# EAGLE design PCB (EAGLE 9.6.1)
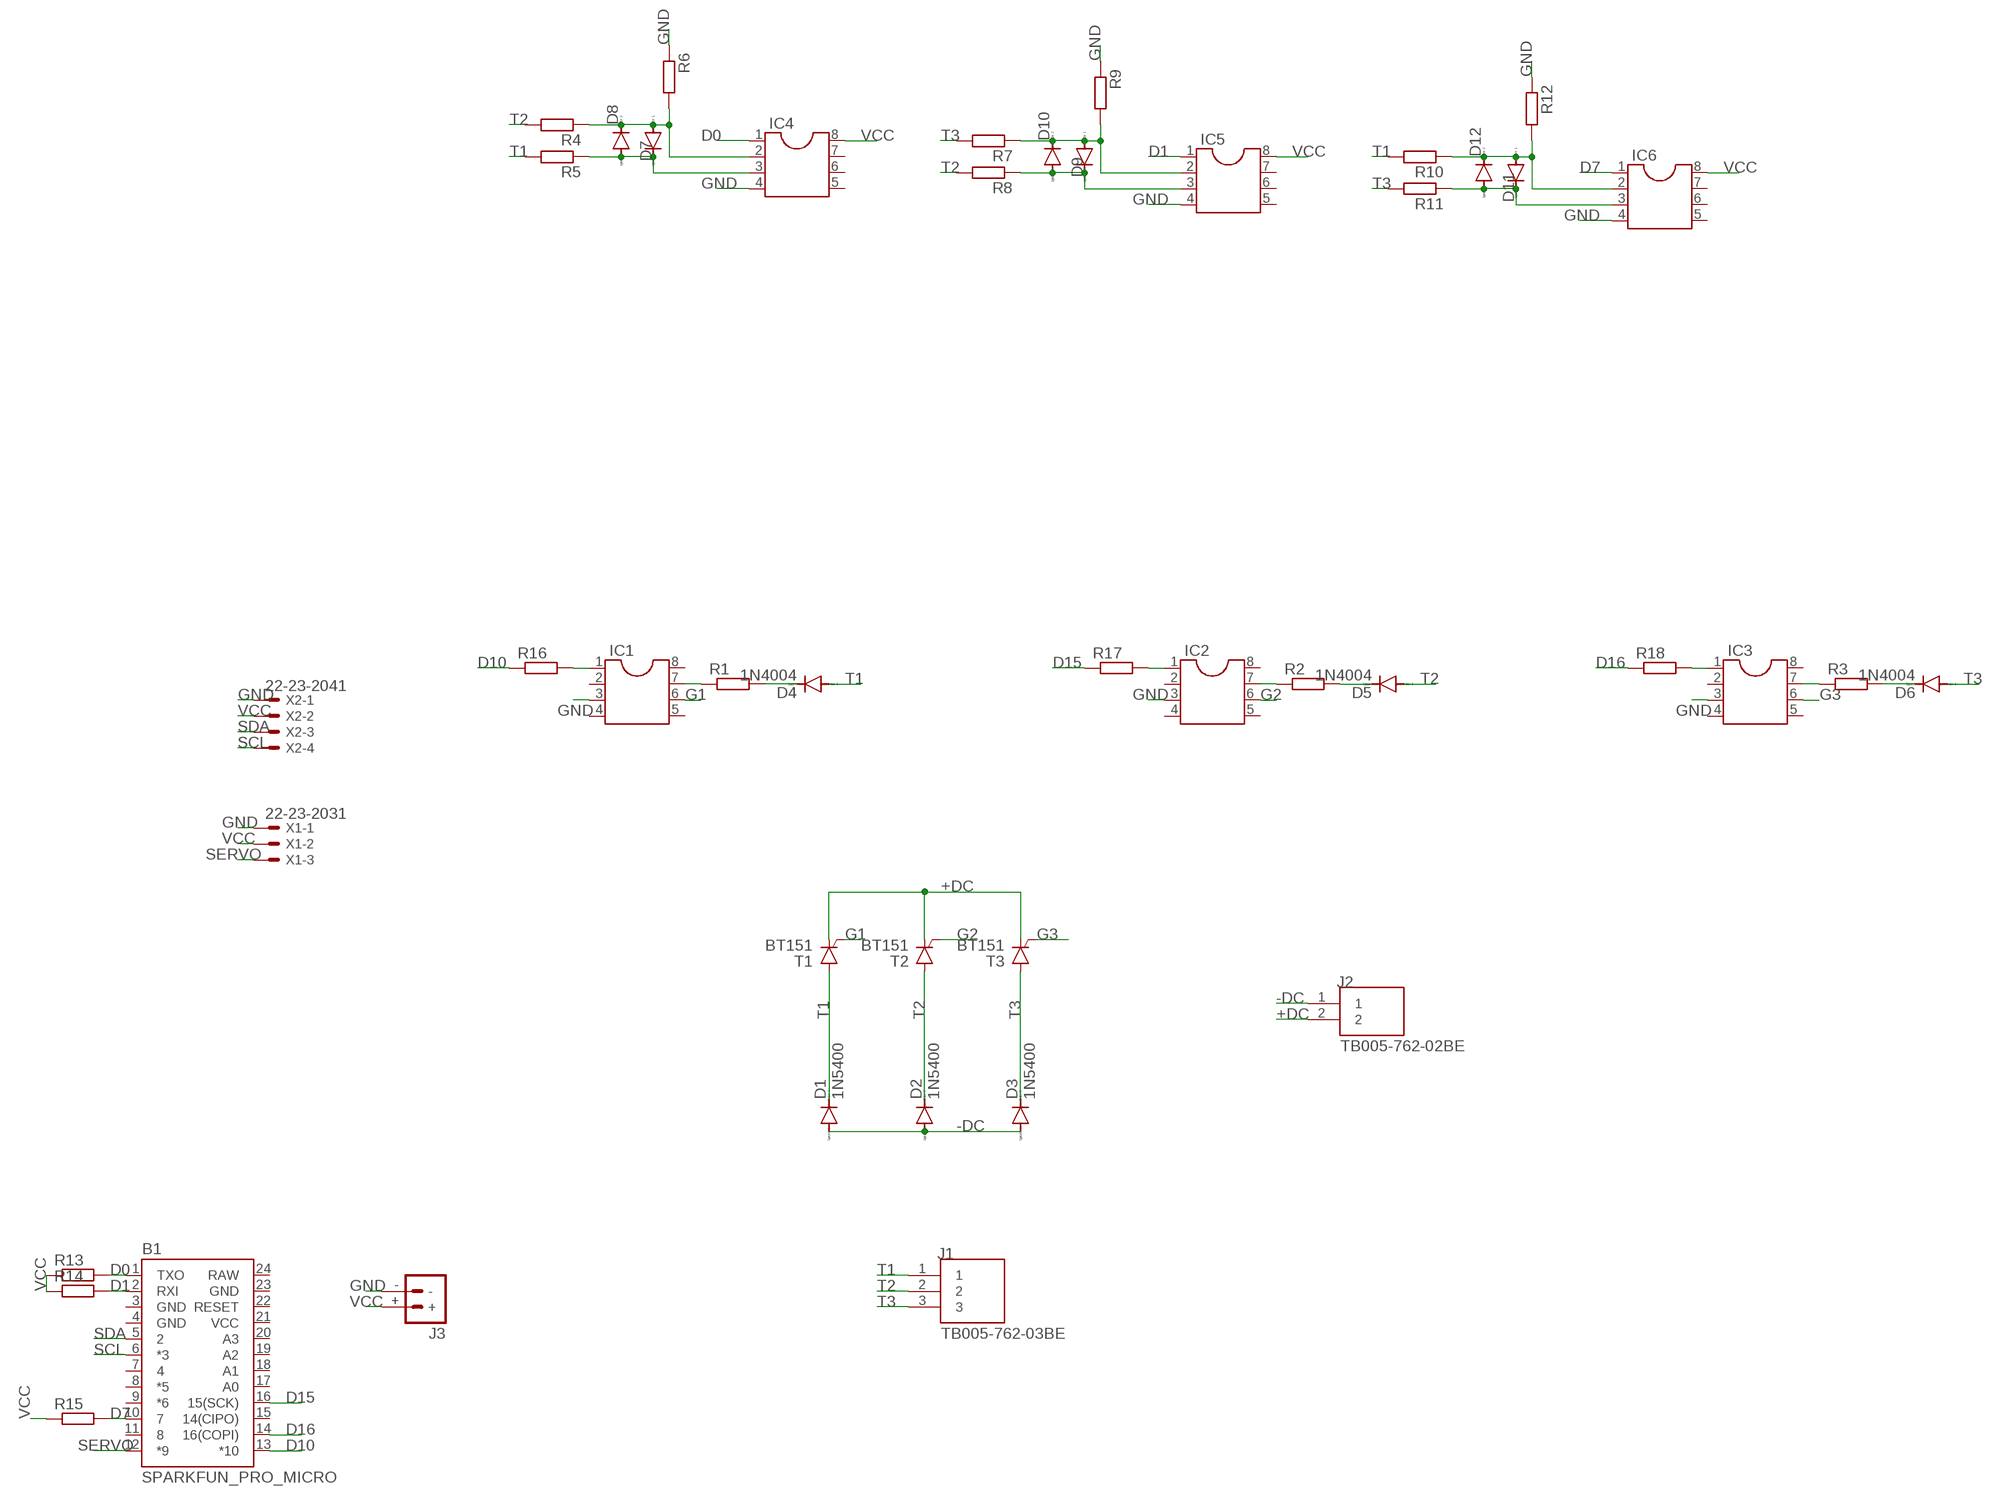
[diagram p0: schematic, sheet 1]

## Parts
B1  SPARKFUN_PRO_MICRO  [SPARKFUN_PRO_MICRO]
D1  1N5400  [DO201-15]
D2  1N5400  [DO201-15]
D3  1N5400  [DO201-15]
D4  1N4004  [DO41-10]
D5  1N4004  [DO41-10]
D6  1N4004  [DO41-10]
D7  1N4004  [DO41-10]
D8  1N4004  [DO41-10]
D9  1N4004  [DO41-10]
D10  1N4004  [DO41-10]
D11  1N4004  [DO41-10]
D12  1N4004  [DO41-10]
IC1  DIL8  [DIL08]
IC2  DIL8  [DIL08]
IC3  DIL8  [DIL08]
IC4  DIL8  [DIL08]
IC5  DIL8  [DIL08]
IC6  DIL8  [DIL08]
J1  TB005-762-03BE  [CUI_TB005-762-03BE]
J2  TB005-762-02BE  [CUI_TB005-762-02BE]
J3  BATTERY_CONN_DEANS  [DEANS]
R1  R-EU_0207/10  [0207/10]
R2  R-EU_0207/10  [0207/10]
R3  R-EU_0207/10  [0207/10]
R4  R-EU_0207/10  [0207/10]
R5  R-EU_0207/10  [0207/10]
R6  R-EU_0207/10  [0207/10]
R7  R-EU_0207/10  [0207/10]
R8  R-EU_0207/10  [0207/10]
R9  R-EU_0207/10  [0207/10]
R10  R-EU_0207/10  [0207/10]
R11  R-EU_0207/10  [0207/10]
R12  R-EU_0207/10  [0207/10]
R13  R-EU_0207/10  [0207/10]
R14  R-EU_0207/10  [0207/10]
R15  R-EU_0207/10  [0207/10]
R16  R-EU_0207/10  [0207/10]
R17  R-EU_0207/10  [0207/10]
R18  R-EU_0207/10  [0207/10]
T1  BT151  [TO220CL]
T2  BT151  [TO220CL]
T3  BT151  [TO220CL]
X1  22-23-2031  [22-23-2031]
X2  22-23-2041  [22-23-2041]

## Nets
+DC: J2.2 T1.C T2.C T3.C
-DC: D1.A D2.A D3.A J2.1
D0: B1.1(TXO) IC4.1 R13.2
D1: B1.2(RXI) IC5.1 R14.2
D7: B1.10 IC6.1 R15.2
D10: B1.13(*10) R16.1
D15: B1.16(15(SCK)) R17.1
D16: B1.14(16(COPI)) R18.1
G1: IC1.6 T1.G
G2: IC2.6 T2.G
G3: IC3.6 T3.G
GND: IC1.3 IC2.3 IC3.3 IC4.4 IC5.4 IC6.4 J3.- R6.1 R9.1 R12.1 X1.1 X2.1
N$1: IC1.1 R16.2
N$2: IC2.1 R17.2
N$3: D7.C D8.A IC4.3 R5.1
N$4: D7.A D8.C IC4.2 R4.1 R6.2
N$5: IC3.1 R18.2
N$6: IC1.7 R1.1
N$7: D4.C R1.2
N$8: IC2.7 R2.1
N$9: D5.C R2.2
N$10: IC3.7 R3.1
N$11: D6.C R3.2
N$14: D9.C D10.A IC5.3 R8.1
N$15: D9.A D10.C IC5.2 R7.1 R9.2
N$20: D11.C D12.A IC6.3 R11.1
N$21: D11.A D12.C IC6.2 R10.1 R12.2
SCL: B1.6(*3) X2.4
SDA: B1.5 X2.3
SERVO: B1.12(*9) X1.3
T1: D1.C D4.A J1.1 R5.2 R10.2 T1.A
T2: D2.C D5.A J1.2 R4.2 R8.2 T2.A
T3: D3.C D6.A J1.3 R7.2 R11.2 T3.A
VCC: IC4.8 IC5.8 IC6.8 J3.+ R13.1 R14.1 R15.1 X1.2 X2.2
Unconnected: B1.7 B1.8(*5) B1.9(*6) B1.11 B1.15(14(CIPO)) B1.17(A0) B1.18(A1) B1.19(A2) B1.20(A3) B1.22(RESET) IC1.2 IC1.4 IC1.5 IC1.8 IC2.2 IC2.4 IC2.5 IC2.8 IC3.2 IC3.4 IC3.5 IC3.8 IC4.5 IC4.6 IC4.7 IC5.5 IC5.6 IC5.7 IC6.5 IC6.6 IC6.7

## Power pins joined to a net without a drawn wire
GND: B1.3(GND) B1.4(GND) B1.23(GND)
RAW: B1.24(RAW)
VCC: B1.21(VCC)

## Library data of the parts
B1 = SparkFun-Boards:SPARKFUN_PRO_MICRO: SparkFun Pro Micro Atmega32U4 compatible footprint. SparkFun Products: 3.3V/8MHz <https://www.sparkfun.com/products/12587> 5V/16MHz <https://www.sparkfun.com/products/12640>
D1-D3 = diode:1N5400: DIODE standard rectifier, 3 A, 50 V (Motorola)
D4-D12 = diode:1N4004: DIODE general purpose rectifier, 1 A
IC1-IC6 = ic-package:DIL8: Dual In Line / Socket
J1 = TB005-762-03BE:TB005-762-03BE: Check availability <https://pricing.snapeda.com/parts/TB005-762-03BE/CUI%20Devices/view-part?ref=eda>; AVAILABILITY: In Stock; CUI_PURCHASE_URL: https://www.cuidevices.com/product/interconnect/connectors/terminal-blocks/tb005-762-series?utm_source=snapeda.com&utm_medium=referral&utm_campaign=snapedaBOM; DESCRIPTION: 2~24 Poles, Screw Type, Horizontal, 7.62 Pitch, 26~10 (AWG), Terminal Block Connector; MF: CUI Devices; MP: TB005-762-03BE; PACKAGE: None; PRICE: None; PURCHASE-URL: https://pricing.snapeda.com/search/part/TB005-762-03BE/?ref=eda
J2 = TB005-762-02BE:TB005-762-02BE; CUI_PURCHASE_URL: https://www.cuidevices.com/product/interconnect/connectors/terminal-blocks/tb005-762-series?utm_source=snapeda.com&utm_medium=referral&utm_campaign=snapedaBOM; DESCRIPTION: 2~24 Poles, Screw Type, Horizontal, 7.62 Pitch, 26~10 (AWG), Terminal Block Connector; DIGI-KEY_PART_NUMBER: 102-6189-ND; MF: CUI Devices; MP: TB005-762-02BE; PACKAGE: None; PURCHASE-URL: https://pricing.snapeda.com/search/part/TB005-762-02BE/?ref=eda
J3 = SparkFun-Connectors:BATTERY_CONN: Battery Connectors Various footprints for battery connections SparkFun Products: Deans Connector -M/F Pair <https://www.sparkfun.com/products/11864>; SF_ID: PRT-11864
R1-R18 = rcl:R-EU_: RESISTOR, European symbol; SPICEPREFIX: R
T1-T3 = triac:BT151: THYRISTOR
X1 = con-molex:22-23-2031: .100" (2.54mm) Center Header - 3 Pin; MF: MOLEX; MPN: 22-23-2031; OC_FARNELL: 1462950; OC_NEWARK: 30C0862
X2 = con-molex:22-23-2041: .100" (2.54mm) Center Header - 4 Pin; MF: MOLEX; MPN: 22-23-2041; OC_FARNELL: 1462920; OC_NEWARK: 38C0355

## Net classes
0 default: width 0.203 mm

## Board
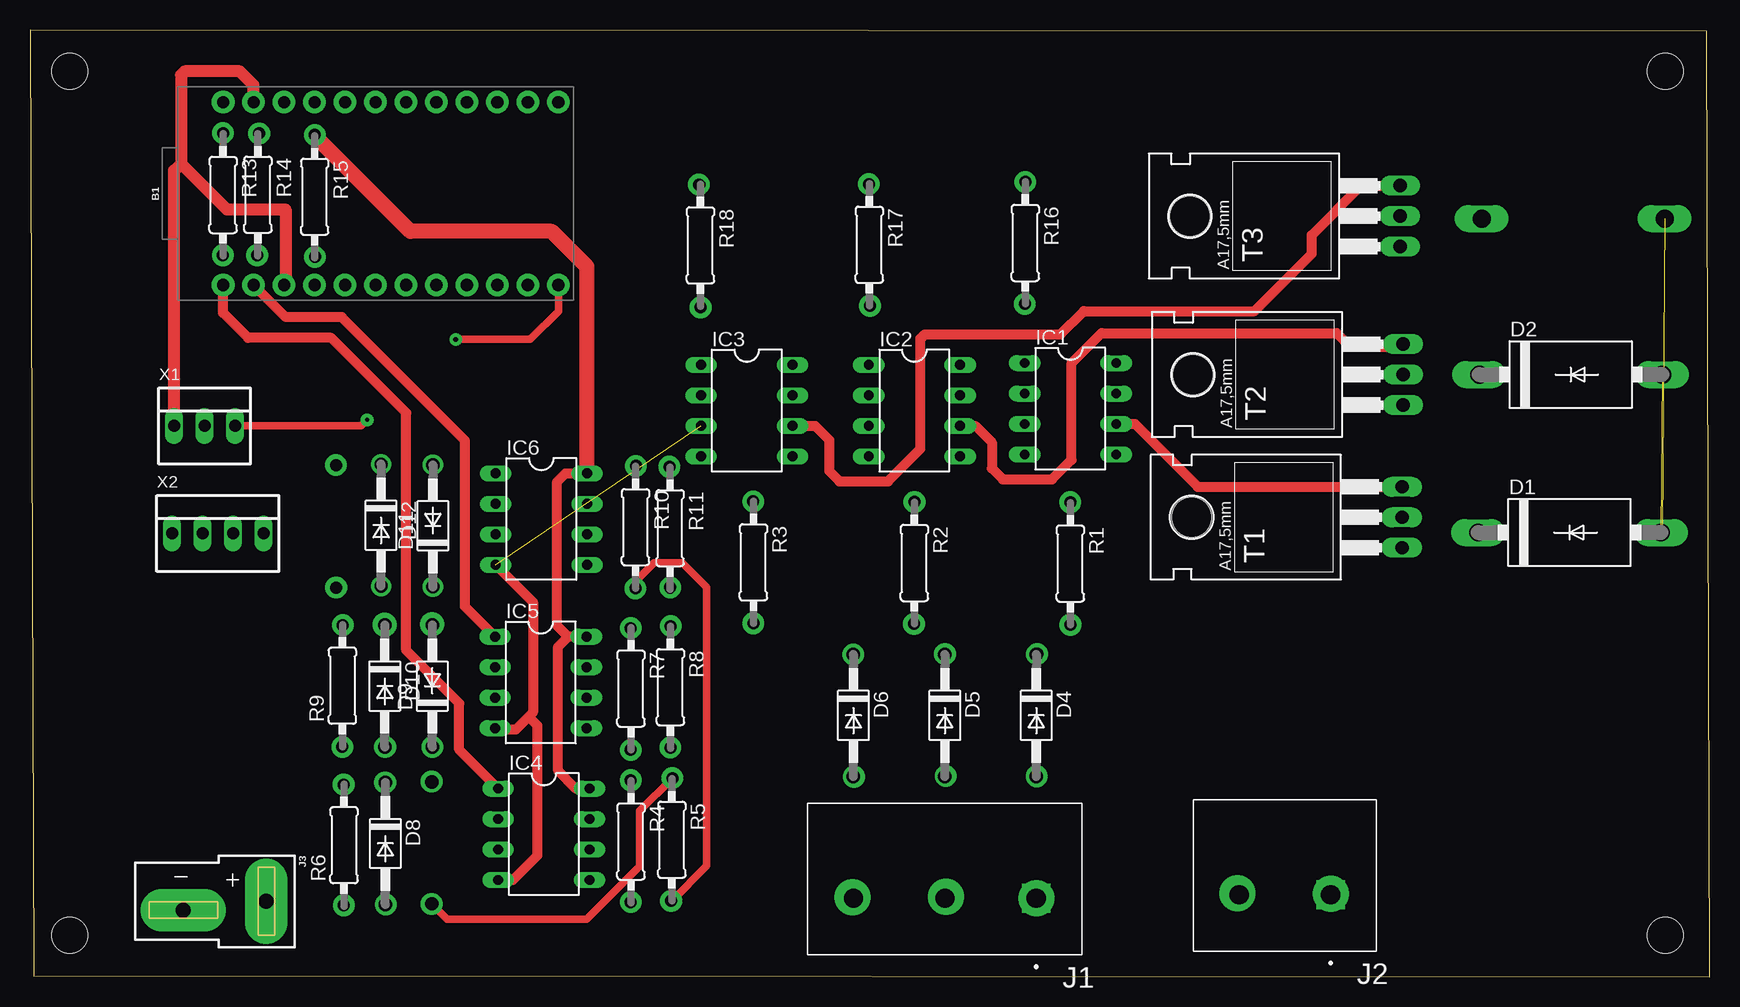
[diagram p1: board, top side]
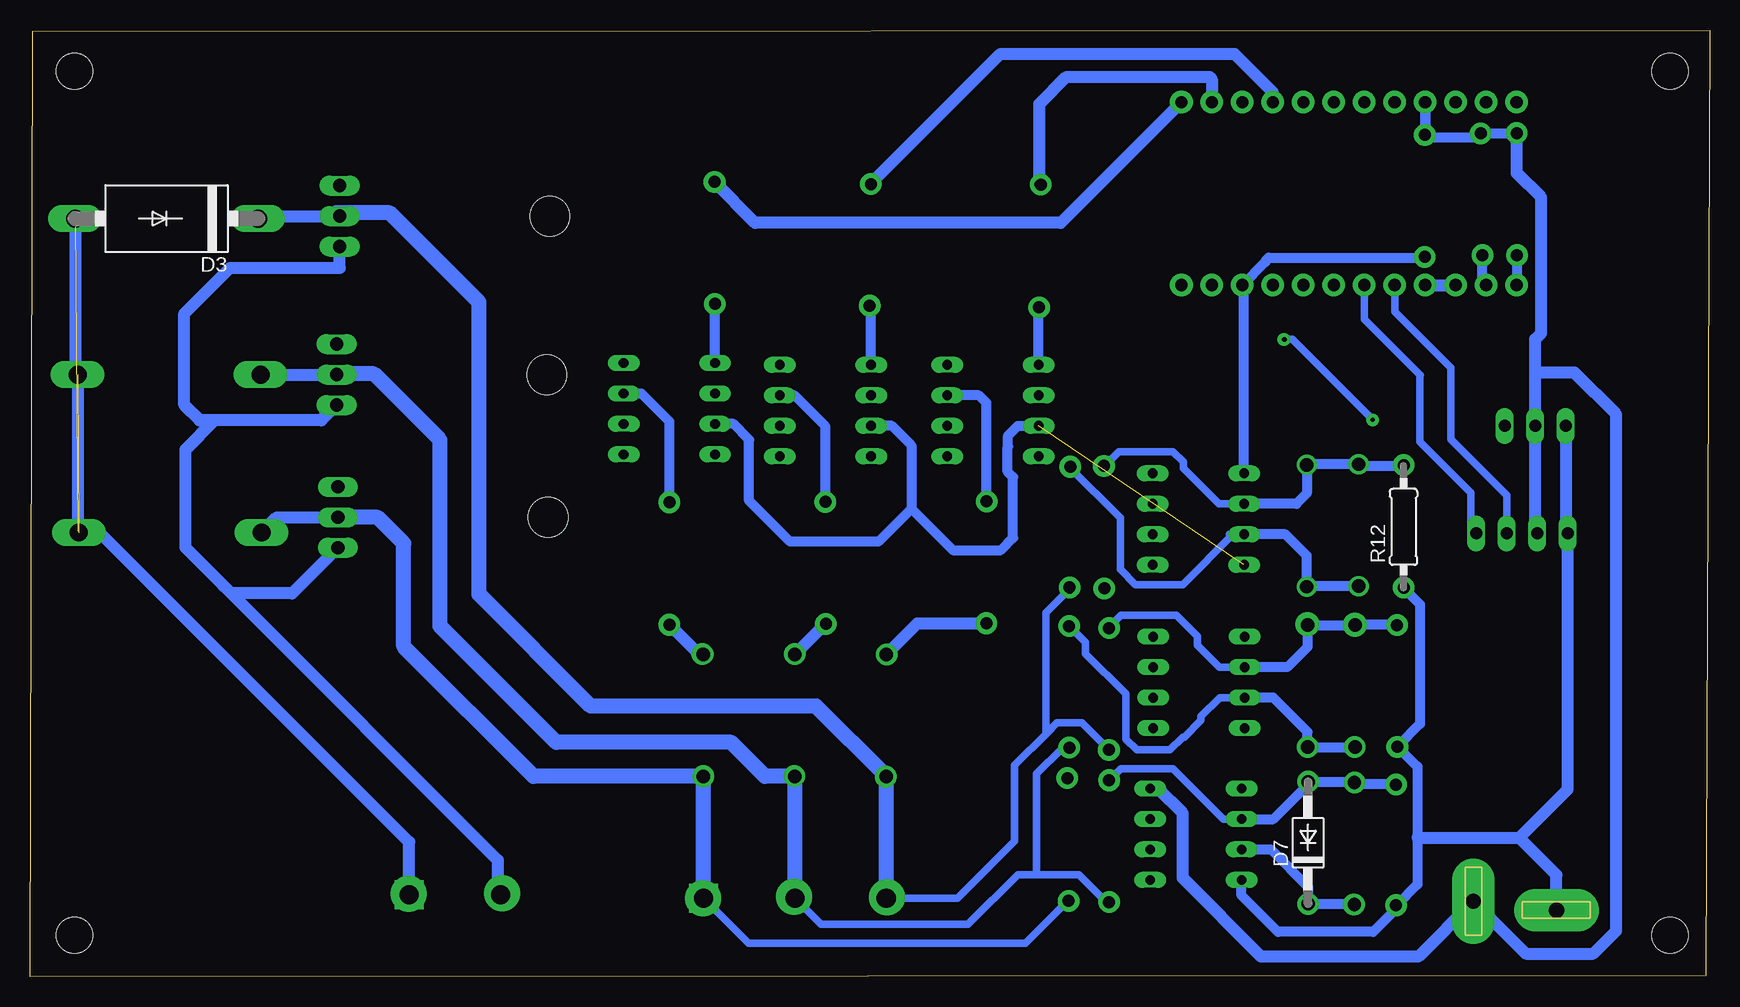
[diagram p2: board, bottom side, seen from below]

Size 140.02 x 78.89 mm. Coordinates in mm from the lower left corner, seen from the top.
Outline: 0.32,0.09 140.02,0 139.79,78.8 0,78.89 0.32,0.09
Copper layers (1*16): Top 0.035mm / dielectric 1.5mm / Bottom 0.035mm
Design rules "default": minimum track width 6mil, minimum drill 0.35mm, track to track 6mil, track to pad 6mil, pad to pad 6mil, via to via 6mil, smd to smd 6mil, copper to edge 40mil, drill to drill 6mil, minimum pad ring 10mil, minimum via ring 8mil, stop-mask expansion 4mil, vias tented up to drill 0mil, thermal gap 10mil
Holes 3 mm at 3.32,75.46 3.32,3.46 136.32,75.46 136.32,3.46

### Footprints (pad centres in the part's own frame; a part is rotated, then mirrored left to right if it is on the bottom)
SPARKFUN_PRO_MICRO = drill 1.016 pad 1.88: 1 -7.62,12.7; 2 -7.62,10.16; 3 -7.62,7.62; 4 -7.62,5.08; 5 -7.62,2.54; 6 -7.62,0; 7 -7.62,-2.54; 8 -7.62,-5.08; 9 -7.62,-7.62; 10 -7.62,-10.16; 11 -7.62,-12.7; 12 -7.62,-15.24; 13 7.62,-15.24; 14 7.62,-12.7; 15 7.62,-10.16; 16 7.62,-7.62; 17 7.62,-5.08; 18 7.62,-2.54; 19 7.62,0; 20 7.62,2.54; 21 7.62,5.08; 22 7.62,7.62; 23 7.62,10.16; 24 7.62,12.7
DO201-15 = drill 1.499 long: A 7.62,0; C -7.62,0
DO41-10 = drill 1.118: A 5.08,0; C -5.08,0
DIL08 = drill 0.813 long: 1 -3.81,-3.81; 2 -1.27,-3.81; 3 1.27,-3.81; 4 3.81,-3.81; 5 3.81,3.81; 6 1.27,3.81; 7 -1.27,3.81; 8 -3.81,3.81
CUI_TB005-762-03BE = drill 1.6 square: 1 0,0 | drill 1.6: 2 7.62,0; 3 15.24,0
CUI_TB005-762-02BE = drill 1.6 square: 1 0,0 | drill 1.6: 2 7.62,0
DEANS = drill 1.27 pad 3.556 long: + 0,0; - 0.737,-6.921
0207/10 = drill 0.813 octagon: 1 -5.08,0; 2 5.08,0
TO220CL = drill 1.118 long: A 0,-6.35; C -2.54,-6.35; G 2.54,-6.35 | hole 3.302: 0,11.176
22-23-2031 = drill 1 long: 1 -2.54,0; 2 0,0; 3 2.54,0
22-23-2041 = drill 1 long: 1 -3.81,0; 2 -1.27,0; 3 1.27,0; 4 3.81,0

### Placement (x,y rotation side)
B1  28.8,65.26 90 top
D1  128.33,37.02 0 top
D2  128.43,50.17 0 top
D3  128.63,63.18 180 bottom
D4  83.88,21.78 270 top
D5  76.26,21.78 270 top
D6  68.64,21.78 270 top
D7  33.48,11.16 90 bottom
D8  29.62,11.11 270 top
D9  33.54,24.22 90 top
D10  29.57,24.22 270 top
D11  33.59,37.58 90 top
D12  29.27,37.63 270 top
IC1  86.72,47.33 270 top
IC2  73.72,47.18 270 top
IC3  59.75,47.18 270 top
IC4  42.83,11.87 270 top
IC5  42.58,24.52 270 top
IC6  42.62,38.14 270 top
J1  83.88,6.54 180 top
J2  108.42,6.84 180 top
J3  19.7,6.28 270 top
R1  86.72,34.43 270 top
R2  73.72,34.48 270 top
R3  60.31,34.53 270 top
R4  50.1,11.26 270 top
R5  53.5,11.41 270 top
R6  26.18,10.96 90 top
R7  50.1,24.01 270 top
R8  53.38,24.13 270 top
R9  26.04,24.25 90 top
R10  50.48,37.47 270 top
R11  53.36,37.38 270 top
R12  25.53,37.49 90 bottom
R13  16.1,65.15 270 top
R14  18.99,65.17 270 top
R15  23.73,65 270 top
R16  82.96,61.15 270 top
R17  69.96,60.99 270 top
R18  55.89,60.94 270 top
T1  108.01,38.29 90 top
T2  108.11,50.17 90 top
T3  107.86,63.38 90 top
X1  14.56,45.9 0 top
X2  15.65,36.94 0 top

### Tracks (layer width: path | path; a pad name or v marks a point on that pad's centre or on a via)
+DC
  Bottom 1.016: T2.C 115.73,46.36 124.62,46.36 | 124.62,46.36 125.89,46.36 127.16,47.63 127.16,55.25 123.35,59.06 114.21,59.06 T3.C | T1.C 118.17,31.94 123.25,31.94 | 124.62,46.36 127.06,43.93 127.06,35.75 123.88,32.57 123.25,31.94 | 123.25,31.94 101.02,9.71 101.02,7.98 100.79,7.76 J2.2
-DC  (2 unrouted)
  Bottom 1.016: D3.A 136.25,50.38 D2.A 136.05,37.12 D1.A 134.22,37.02 108.41,11.21 J2.1
D0
  Top 0.813: IC4.1 35.78,18.92 35.78,22.77 31.37,27.19 31.37,46.99 25.12,53.24 18.18,53.24 16.1,55.32 B1.1
  Bottom 0.813: R13.2 B1.1
D1
  Top 0.813: IC5.1 36.26,30.84 36.26,44.68 25.98,54.96 21.32,54.96 B1.2
  Bottom 0.813: R14.2 18.99,57.99 B1.2
D7
  Bottom 0.813: R15.2 36.77,59.92 37.03,59.66 37.03,59.57 B1.10 38.81,57.49 IC6.1
D10
  Bottom 1.016: B1.13 54.1,62.83 79.56,62.83 R16.1
D15
  Bottom 1.016: R17.1 59.12,76.91 39.62,76.91 36.42,73.72 B1.16
D16
  Bottom 1.016: R18.1 55.89,72.7 53.61,74.98 41.68,74.98 41.5,74.8 B1.14
G1
  Top 0.813: IC1.6 92.11,46.06 97.34,40.83 T1.G
G2
  Top 0.813: IC2.6 78.8,45.91 80.17,44.54 80.17,42.35 81.08,41.44 85.2,41.44 86.82,43.06 86.82,51.14 89.31,53.63 108.92,53.63 110.04,52.51 114.26,52.51 T2.G
G3
  Top 0.813: IC3.6 65.44,45.91 66.61,44.74 66.61,42.15 67.47,41.28 71.53,41.28 74.23,43.98 74.23,50.58 74.23,51.19 74.23,53.17 74.58,53.53 85.91,53.53 87.84,55.46 102.06,55.46 106.84,60.23 106.84,61.81 110.95,65.92 T3.G
GND  (1 unrouted)
  Top 0.813: IC6.4 41.94,31.21 41.94,22.04 41.56,21.66 | 41.56,21.66 40.48,20.58 38.9,20.58 IC5.4 | 41.56,21.66 42.28,20.95 42.28,10.08 40.26,8.06 IC4.4
  Top 1.016: B1.23 18.64,74.3 17.49,75.45 12.89,75.45 12.59,75.15 12.59,67.75 | B1.3 21.3,57.76 21.3,63.94 16.4,63.94 12.59,67.75 | X1.1 12.02,67.18 12.59,67.75
  Bottom 0.813: IC2.3 68.18,45.91 66.56,44.28 66.56,39 | 66.56,39 63.1,35.54 59.09,35.54 58.07,36.56 58.07,41.64 58.53,42.1 58.53,44.13 58.48,44.18 58.48,45.09 57.67,45.91 IC3.3 | 66.56,39 69.3,36.26 76.66,36.26 80.07,39.66 80.07,44.74 81.39,46.06 IC1.3 | R12.1 24.15,31.03 24.15,21.07 R9.1 24.37,17.5 24.37,11.58 24.37,7.68 R6.1 26.18,5.62 28.05,3.75 35.99,3.75 39.02,6.78 IC4.4
  Bottom 1.016: J3.- 12.77,8.48 15.88,11.58 | 24.37,11.58 15.88,11.58 | 15.88,11.58 11.84,15.62 X2.1 12.02,37.11 X1.1 | B1.4 B1.3
N$1
  Bottom 0.813: R16.2 82.96,51.19 IC1.1
N$2
  Bottom 0.813: IC2.1 69.91,55.86 R17.2
N$3
  Top 0.61: D7.C 34.78,4.78 46.41,4.78 50.82,9.19 50.82,13.82 R5.1
  Bottom 0.813: D8.A 29.67,6.08 D7.C 33.48,7.5 36.58,10.6 IC4.3
N$4
  Bottom 0.61: IC4.2 40.54,13.14 44.74,17.34 49.1,17.34 R4.1
  Bottom 0.813: 33.43,16.19 D8.C 29.48,16.04 R6.2 | 33.43,16.19 D7.A | IC4.2 36.38,13.14 33.43,16.09 33.43,16.19
N$5
  Bottom 0.813: IC3.1 55.94,55.81 R18.2
N$6
  Bottom 0.813: R1.1 86.72,46.26 89.06,48.6 IC1.7
N$7
  Bottom 1.016: R1.2 84.23,26.86 D4.C
N$8
  Bottom 0.813: R2.1 73.72,45.86 76.31,48.45 IC2.7
N$9
  Bottom 1.016: D5.C R2.2
N$10
  Bottom 0.813: R3.1 60.31,47.84 60.92,48.45 IC3.7
N$11
  Bottom 1.016: D6.C 66.05,29.45 R3.2
N$12  (via drill 0.35 pad 1.05)
  other vias: 28.1,46.41
N$13  (via drill 1 pad 2)
  other vias: 33.52,29.36
N$14
  Bottom 0.61: IC5.3 40.85,23.25 42.4,21.7 42.4,21.36 43.8,19.95 43.93,19.95 44.99,18.89 47.76,18.89 48.66,19.8 48.66,23.57 52.02,26.93 52.02,27.86 R8.1
  Bottom 0.813: D10.A D9.C 33.54,20.41 36.38,23.25 IC5.3
N$15
  Bottom 0.61: R7.1 49.07,30.12 44.47,30.12 42.71,28.37 42.71,27.62 40.89,25.79 IC5.2
  Bottom 0.813: IC5.2 35.21,25.79 33.54,27.47 D9.A D10.C 29.54,29.33 R9.2
N$16  (via drill 1 pad 2)
  other vias: 29.58,29.31
N$17  (via drill 1 pad 1.8)
  other vias: 26.07,29.29
N$18  (via drill 1 pad 1.8)
  other vias: 25.52,32.43
N$19  (via drill 1 pad 1.8)
  other vias: 25.51,42.63
N$20
  Bottom 0.61: IC6.3 40.03,36.87 | 53.36,42.47 R11.1 49.13,38.23 49.13,33.94 47.87,32.68 43.92,32.68 39.74,36.87 38.41,36.87
  Bottom 0.813: D12.A 33.54,32.55 D11.C 33.59,35.09 35.37,36.87 38.41,36.87 IC6.3
N$21
  Bottom 0.61: 50.48,42.02 R10.1 49.26,43.76 44.73,43.76 43.88,42.91 43.88,42.37 40.92,39.41 IC6.2
  Bottom 0.813: IC6.2 34.45,39.41 33.59,40.27 D11.A 33.54,42.71 D12.C 29.13,42.57 R12.2
N$22  (via drill 1 pad 1.8)
  other vias: 23.76,59.98
N$23  (via drill 1 pad 1.8)
  other vias: 18.94,60.12
N$24  (via drill 1 pad 1.8)
  other vias: 16.07,60.12
N$25  (via drill 1 pad 1.8)
  other vias: 16.09,70.31
N$26  (via drill 1 pad 1.8)
  other vias: 19.1,70.28
N$27  (via drill 1 pad 1.8)
  other vias: 23.75,70.15
N$28  (via drill 1 pad 1.8)
  other vias: 55.76,66.01
N$29  (via drill 1 pad 1.8)
  other vias: 55.9,55.78
N$30  (via drill 1 pad 1.8)
  other vias: 70.02,55.92
N$31  (via drill 1 pad 1.8)
  other vias: 69.93,66.06
N$32  (via drill 1 pad 1.8)
  other vias: 82.96,66.24
N$33  (via drill 1 pad 1.8)
  other vias: 82.92,56.07
N$34  (via drill 1 pad 1.8)
  other vias: 60.3,29.46
N$35  (via drill 1 pad 1.8)
  other vias: 73.69,29.4
N$36  (via drill 1 pad 1.8)
  other vias: 86.73,29.33
N$37  (via drill 1 pad 1.8)
  other vias: 86.72,39.54
N$38  (via drill 1 pad 1.8)
  other vias: 73.73,39.56
N$39  (via drill 1 pad 1.8)
  other vias: 60.28,39.61
N$40  (via drill 1 pad 1.8)
  other vias: 53.3,42.49
N$41  (via drill 1 pad 1.8)
  other vias: 50.5,42.57
N$42  (via drill 1 pad 1.8)
  other vias: 53.36,32.45
N$43  (via drill 1 pad 1.8)
  other vias: 50.47,32.35
N$44  (via drill 1 pad 1.8)
  other vias: 50.07,29.05
N$45  (via drill 1 pad 1.8)
  other vias: 53.41,29.21
N$46  (via drill 1 pad 1.8)
  other vias: 50.07,16.37
N$47  (via drill 1 pad 1.8)
  other vias: 53.55,16.55
N$48  (via drill 1 pad 1.8)
  other vias: 53.39,19.09
N$49  (via drill 1 pad 1.8)
  other vias: 50.08,18.9
N$50  (via drill 1 pad 1.8)
  other vias: 50.08,6.21
N$51  (via drill 1 pad 1.8)
  other vias: 53.44,6.32
N$52  (via drill 1 pad 1.8)
  other vias: 33.48,6.05
N$53  (via drill 1 pad 1.8)
  other vias: 29.66,6.03
N$54  (via drill 1 pad 1.8)
  other vias: 26.16,5.95
N$55  (via drill 1 pad 1.8)
  other vias: 26.15,16.01
N$56  (via drill 1 pad 1.8)
  other vias: 29.6,16.17
N$57  (via drill 1 pad 1.8)
  other vias: 33.48,16.26
N$58  (via drill 1 pad 1.8)
  other vias: 26.04,19.15
N$59  (via drill 1 pad 1.8)
  other vias: 29.6,19.14
N$60  (via drill 1 pad 1.8)
  other vias: 33.53,19.14
N$61  (via drill 1 pad 1.8)
  other vias: 83.96,26.91
N$62  (via drill 1 pad 1.8)
  other vias: 76.27,26.91
N$63  (via drill 1 pad 1.8)
  other vias: 68.62,26.85
N$64  (via drill 1 pad 1.8)
  other vias: 68.69,16.66
N$65  (via drill 1 pad 1.8)
  other vias: 76.32,16.72
N$66  (via drill 1 pad 1.8)
  other vias: 83.9,16.7
N$67  (via drill 1 pad 1.8)
  other vias: 100.81,6.86
N$68  (via drill 1 pad 1.8)
  other vias: 108.45,6.89
N$69  (via drill 1 pad 1.8)
  other vias: 68.65,6.51
N$70  (via drill 1 pad 1.8)
  other vias: 76.28,6.56
N$71  (via drill 1 pad 1.8)
  other vias: 83.86,6.57
N$72  (via drill 1 pad 3)
  other vias: 68.57,6.61
N$73  (via drill 1 pad 3)
  other vias: 76.33,6.68
N$74  (via drill 1 pad 3)
  other vias: 83.92,6.55
N$75  (via drill 1 pad 3)
  other vias: 100.66,6.94
N$76  (via drill 1 pad 3)
  other vias: 108.45,6.91
SCL
  Bottom 0.61: X2.4 19.92,37.39 19.92,40.32 24.18,44.58 24.18,50.08 24.14,50.11 28.8,54.77 B1.6
SDA
  Bottom 0.61: B1.5 26.26,55.41 21.6,50.75 21.6,44.81 16.92,40.13 X2.3
SERVO  (via drill 0.35, 0.35 pad 1.05)
  Top 0.61: X1.3 27.58,45.9 v28.1,46.41 | v35.43,53.1 v35.5,53.1 41.7,53.1 44.06,55.46 44.06,57.62 B1.12
  Bottom 0.61: v28.1,46.41 34.79,53.1 v35.43,53.1
T1
  Top 0.61: R10.2 50.48,32.94 52.04,34.5 54.35,34.5 56.39,32.45 56.39,9.23 R5.2
  Bottom 0.61: R5.2 57.06,2.78 80.12,2.78 J1.1
  Bottom 1.016: D1.C 119.44,38.29 T1.A
  Bottom 1.27: J1.1 D4.A 98.05,16.7 108.87,27.51 108.87,36.12 111.03,38.29 T1.A
T2
  Bottom 0.61: R4.2 50.24,6.18 52.57,8.51 56.12,8.51 | J1.2 74.09,4.36 61.83,4.36 57.68,8.51 56.12,8.51 | R8.2 53.98,19.05 56.12,16.91 56.12,8.51
  Bottom 1.016: D2.C T2.A
  Bottom 1.27: J1.2 D5.A | D5.A 76.39,16.83 | D5.A 78.75,16.7 81.58,19.53 96.15,19.53 105.84,29.22 105.84,44.73 111.35,50.23 114.4,50.23 T2.A
T3
  Bottom 0.61: R7.2 52.32,21.16 54.4,21.16 55.21,20.35 | J1.3 62.72,6.54 57.95,11.31 57.95,17.61 55.21,20.35 | R11.2 55.31,30.34 55.31,20.46 55.21,20.35
  Bottom 1.016: D3.C 120.81,63.38 114.84,63.38 T3.A
  Bottom 1.27: J1.3 D6.A 74.49,22.55 93.28,22.55 102.59,31.86 102.59,56.21 110.03,63.65 114.57,63.65 114.84,63.38
VCC
  Top 0.813: IC4.8 45.49,15.68 44.02,17.15 44.02,27.5 44.85,28.33 | IC5.8 44.85,28.33 | 44.85,28.33 43.95,29.23 43.95,41.26 44.64,41.95 IC6.8
  Top 1.27: IC6.8 46.43,59.18 43.5,62.12 31.69,62.12 R15.1
  Bottom 0.813: R13.1 16.12,70.25 R14.1 19.28,69.96 23.62,69.96 R15.1 B1.21 23.73,72.87 R15.1
  Bottom 1.016: IC4.8 45.99,15.68 43.92,13.61 43.92,8.23 37.37,1.68 24.3,1.68 J3.+ 15.33,1.92 9.71,1.92 7.81,3.82 7.81,46.86 11.29,50.34 14.56,50.34 | X2.2 14.56,37.11 X1.2 14.56,50.34 | 14.56,50.34 14.56,53.13 14.06,53.63 14.06,64.93 16.1,66.97 R13.1